# EAGLE design LPC_2TE_3.11PEsmd_only-rdob-millable (EAGLE 6.6.0)
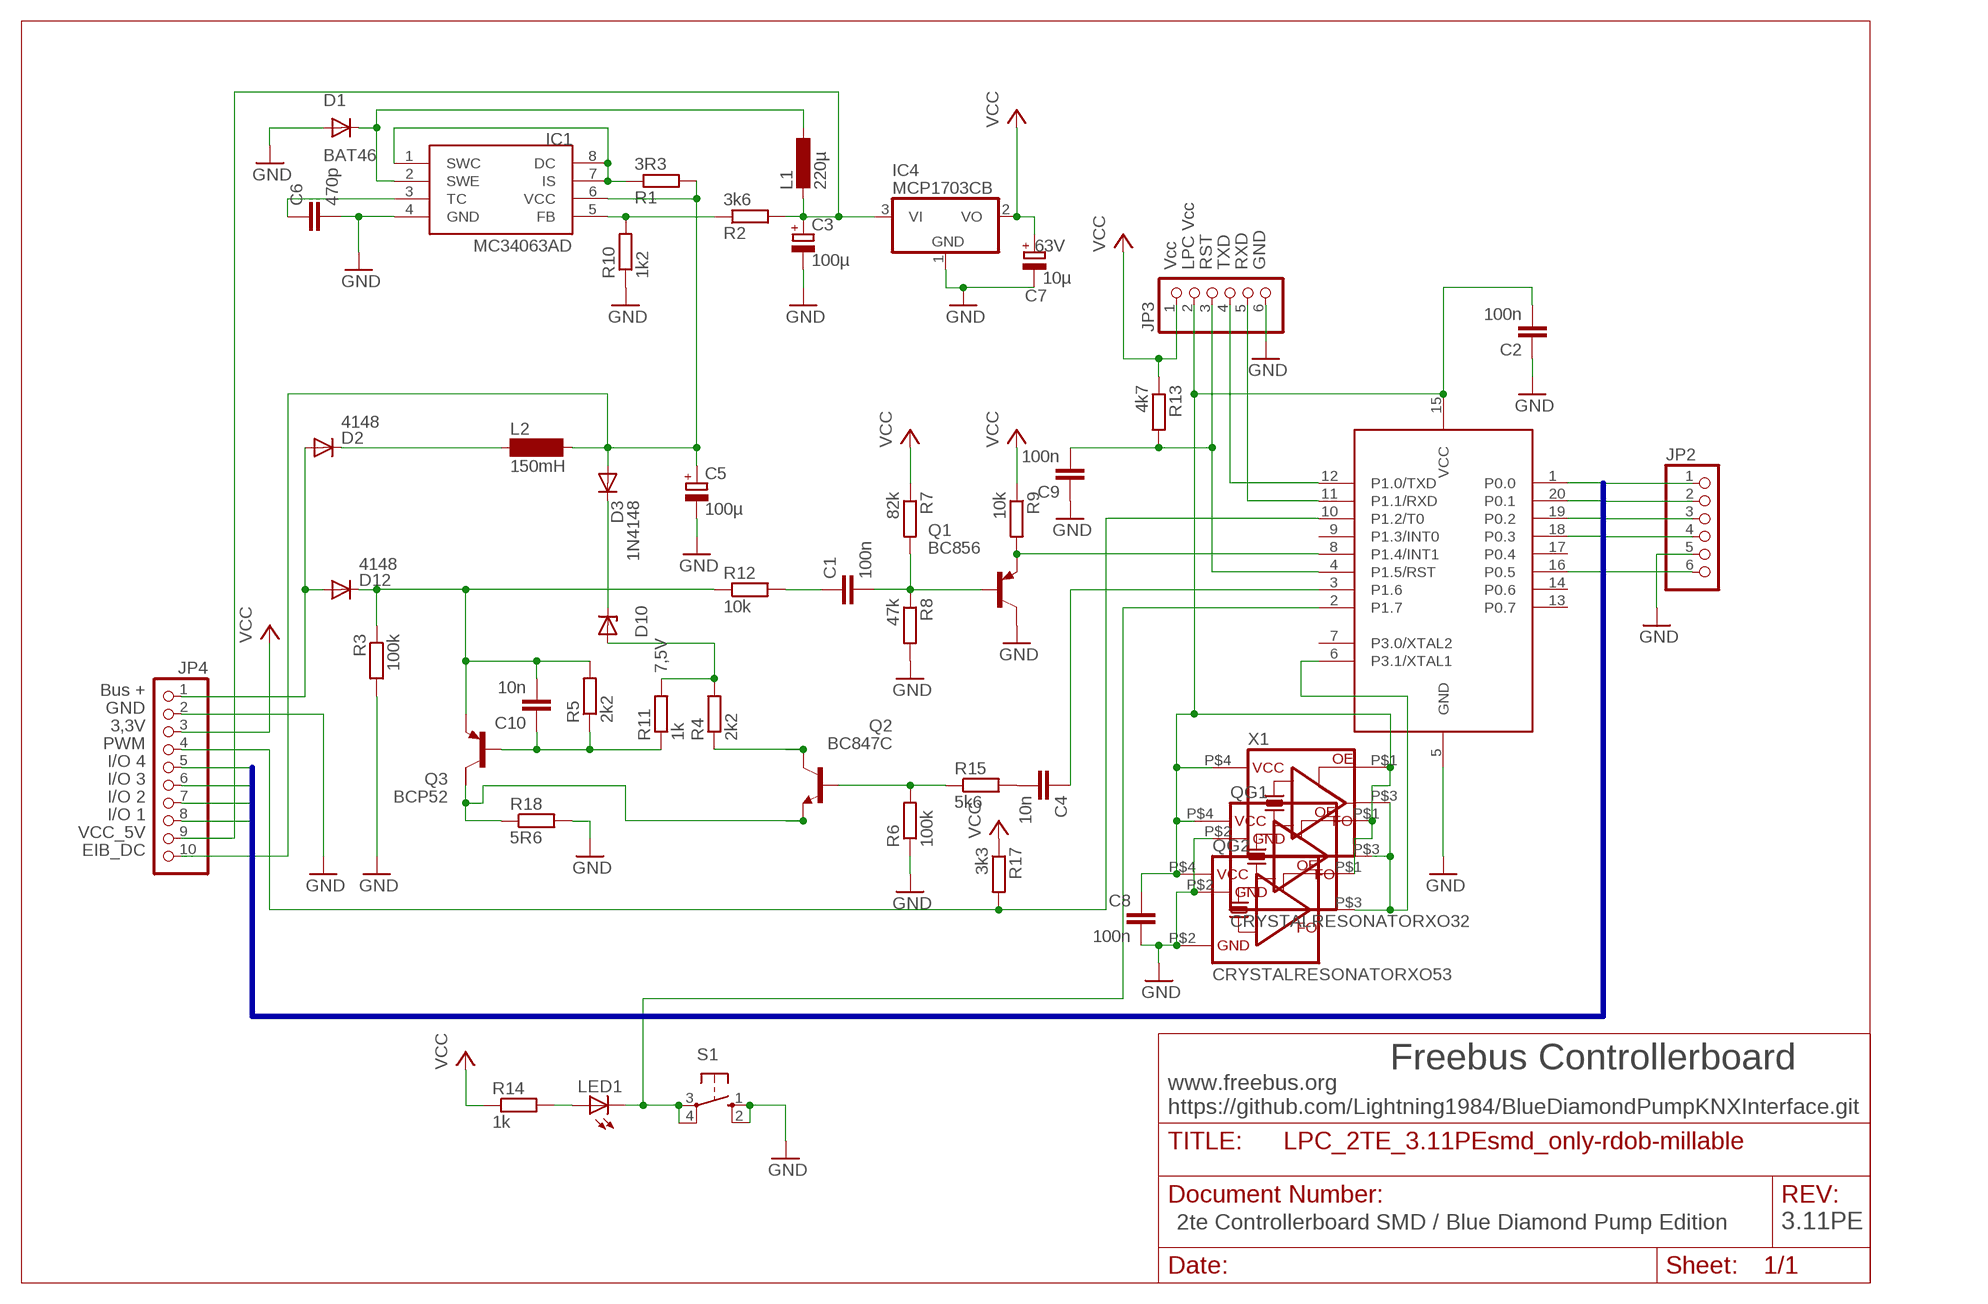
[diagram p0: schematic, sheet 1]

## Parts
C1  100n  C-EUC0805K  [C0805K]
C2  100n  C-EUC0805K  [C0805K]
C3  100µ  CPOL-EUE2.5-6  [E2,5-6]
C4  10n  C-EUC0805K  [C0805K]
C5  100µ  CPOL-EUE3.5-8  [E3,5-8]
C6  470p  C-EUC0805K  [C0805K]
C7  10µ  CPOL-EUE2-5  [E2-5]
C8  100n  C-EUC0805K  [C0805K]
C9  100n  C-EUC0805K  [C0805K]
C10  10n  C-EUC0805K  [C0805K]
D1  BAT46  DIODESOD-123  [SOD-123]
D2  4148  DIODE-MINIMELF  [MINIMELF]
D3  1N4148  DIODE-MINIMELF  [MINIMELF]
D10  7,5V  ZPD  [MINIMELF]
D12  4148  DIODE-MINIMELF  [MINIMELF]
IC1  MC34063AD  [SOIC8]
IC2  LPC922FDH  [TSSOP20]
IC4  MCP1703CB  [SOT23]
JP2  PINHD-1X06_2.54-0.70MM-DRILL  [1X06-0.70DRILL]
JP3  PINHD-1X06_2.54-0.90MM-DRILL  [1X06-0.90DRILL]
JP4  PINHD-1X10_2.54-S0.70MM-DRILL  [1X10-0.70DRILL]
L1  220µ  L-EUPIS28XX  [PIS28XX]
L2  150mH  BS11  [BS11]
LED1  LEDSMT1206  [1206]
Q1  BC856  BC856BSMD  [SOT23-BEC]
Q2  BC847C  BC847CSMD  [SOT23]
Q3  BCP52  FZT753SMD  [SOT223]
QG1  CRYSTALRESONATORXO32  [XO32]
QG2  CRYSTALRESONATORXO53  [XO53]
R1  3R3  R-EU_R1206  [R1206]
R2  3k6  R-EU_R1206  [R1206]
R3  100k  R-EU_R1206  [R1206]
R4  2k2  R-EU_R1206  [R1206]
R5  2k2  R-EU_R1206  [R1206]
R6  100k  R-EU_R1206  [R1206]
R7  82k  R-EU_R1206  [R1206]
R8  47k  R-EU_R1206  [R1206]
R9  10k  R-EU_R1206  [R1206]
R10  1k2  R-EU_R1206  [R1206]
R11  1k  R-EU_R1206  [R1206]
R12  10k  R-EU_R1206  [R1206]
R13  4k7  R-EU_R1206  [R1206]
R14  1k  R-EU_R1206  [R1206]
R15  5k6  R-EU_R1206  [R1206]
R17  3k3  R-EU_R1206  [R1206]
R18  5R6  R-EU_R1206  [R1206]
S1  10-XX  [B3F-10XX]
X1  CRYSTALRESONATORXO91  [XO91]

## Nets
/RESET: C9.2 IC2.4(P1.5/RST) JP3.3 R13.2
BASE: C1.2 Q1.B R7.2 R8.1
BASE_SEND: Q2.1(B) R6.2 R15.1
EIB+: D2.A D12.A JP4.1
EIB_DC: C5.+ D3.A IC1.6(VCC) JP4.10 L2.2 R1.2
FEEDBACK: IC1.5(FB) R2.1 R10.2
GND: C2.1 C3.- C5.- C6.2 C7.- C8.2 C9.1 D1.A IC1.4(GND) IC2.5(GND) IC4.1(GND) JP2.5 JP3.6 JP4.2 Q1.C QG1.P$2(GND) QG2.P$2(GND) R3.2 R6.1 R8.2 R10.1 R18.2 S1.1(S) S1.2(S1) X1.P$2(GND)
I_SENSE: Q2.2(E) Q3.2(C) R18.1
N$1: Q2.3(C) R4.1
N$4: C10.2 D12.C Q3.3(E) R3.1 R5.2 R12.1
N$6: IC2.6(P3.1/XTAL1) QG1.P$3(FO) QG2.P$3(FO) X1.P$3(FO)
N$8: IC1.1(SWC) IC1.7(IS) IC1.8(DC) R1.1
N$9: LED1.A R14.2
N$13: D2.C L2.1
N$14: C6.1 IC1.3(TC)
N$15: D3.C D10.C
N$16: C1.1 R12.2
N$17: C4.2 R15.2
N$28: C10.1 Q3.1(B) R5.1 R11.1
P0.0: IC2.1(P0.0) JP2.1 JP4.8
P0.1: IC2.20(P0.1) JP2.2 JP4.7
P0.2: IC2.19(P0.2) JP2.3 JP4.6
P0.3: IC2.18(P0.3) JP2.4 JP4.5
P0.5: IC2.16(P0.5) JP2.6
PROG: IC2.2(P1.7) LED1.C S1.3(P) S1.4(P1)
PWM: IC2.10(P1.2/T0) JP4.4 R17.2
REFERENZ: D10.A R4.2 R11.2
RXD: IC2.11(P1.1/RXD) JP3.5
SIGIN: IC2.8(P1.4/INT1) Q1.E R9.2
SIGOUT: C4.1 IC2.3(P1.6)
SWITCHED: D1.C IC1.2(SWE) L1.2
TXD: IC2.12(P1.0/TXD) JP3.4
VCC: C7.+ IC4.2(VO) JP3.1 JP4.3 R7.1 R9.1 R13.1 R14.1 R17.1
VCC_5V: C3.+ IC4.3(VI) JP4.9 L1.1 R2.2
VCC_LPC: C2.2 C8.1 IC2.15(VCC) JP3.2 QG1.P$1(OE) QG1.P$4(VCC) QG2.P$1(OE) QG2.P$4(VCC) X1.P$1(OE) X1.P$4(VCC)
Unconnected: IC2.7(P3.0/XTAL2) IC2.9(P1.3/INT0) IC2.13(P0.7) IC2.14(P0.6) IC2.17(P0.4) Q3.4(C/)

## Buses
P0.[0..3]

## Notes on the sheet
- Vcc | LPC Vcc | RST | TXD | RXD | GND
- Bus +
- GND
- 3,3V
- PWM
- I/O 4
- I/O 3
- I/O 2
- I/O 1
- VCC_5V
- EIB_DC
- Freebus Controllerboard
- www.freebus.org
  https://github.com/Lightning1984/BlueDiamondPumpKNXInterface.git
- 2te Controllerboard SMD / Blue Diamond Pump Edition | 3.11PE

## Library data of the parts
C1 C2 C4 C6 C8-C10 = rcl:C-EU: CAPACITOR, European symbol
C3 C5 = rcl:CPOL-EU: POLARIZED CAPACITOR, European symbol
C7 = rcl:CPOL-EU: POLARIZED CAPACITOR, European symbol; VOLTAGE: 63V
D1 = adafruit-2:DIODE: Diode SMADIODE - SMA Surface Mount Package 20V 1A Schottky Diode Digikey: 641-1014-6-ND DO-1N4148 - Through Hole Small Current Diode SOD-123 20V 1 A (.5mV Vf) Schottky Diode - Digikey: MBRX120TPMSCT-ND SOD-323 10V 570mA (.38mV Vf, 3ns) Schottky Diode - Digikey: ZLLS410CT-ND SOD-523 30V 30mA Schottky Diode (RB751S-40TE61) - Digikey: RB751S-40TE61CT-ND SOT23-R/W - SOT23 Package (R = Solder Paste/Reflow Ovens, W = Hand-Soldering) BAT54Film 40V 300mA - Digikey: 497-7162-1-ND
D2 D3 D12 = diode:DIODE-: DIODE
D10 = diode:ZPD: Z DIODE 500 mW
IC1 = mc34063:MC34063
IC2 = LPCGira:LPC922FDH
IC4 = linear:MCP1703: 250 mA, 16V, Low Quiescent Current LDO Regulator Source: http://ww1.microchip.com/downloads/en/DeviceDoc/22049b.pdf
JP2 JP3 = pinhead-2:PINHD-1X06: PIN HEADER
JP4 = pinhead-2:PINHD-1X10: PIN HEADER
L1 = Inductor-Fastron:L-EU
L2 = inductor-neosid:BS: INDUCTOR nominal inductance, magnetically screened
LED1 = led:LED: LED OSRAM: - CHIPLED LG R971, LG N971, LY N971, LG Q971, LY Q971, LO R971, LY R971 LH N974, LH R974 LS Q976, LO Q976, LY Q976 LO Q996 - Hyper CHIPLED LW Q18S LB Q993, LB Q99A, LB R99A - SideLED LS A670, LO A670, LY A670, LG A670, LP A670 LB A673, LV A673, LT A673, LW A673 LH A674 LY A675 LS A676, LA A676, LO A676, LY A676, LW A676 LS A679, LY A679, LG A679 - Hyper Micro SIDELED® LS Y876, LA Y876, LO Y876, LY Y876 LT Y87S - SmartLED LW L88C, LW L88S LB L89C, LB L89S, LG L890 LS L89K, LO L89K, LY L89K LS L896, LA L896, LO L896, LY L896 - TOPLED LS T670, LO T670, LY T670, LG T670, LP T670 LSG T670, LSP T670, LSY T670, LOP T670, LYG T670 LG T671, LOG T671, LSG T671 LB T673, LV T673, LT T673, LW T673 LH T674 LS T676, LA T676, LO T676, LY T676, LB T676, LH T676, LSB T676, LW T676 LB T67C, LV T67C, LT T67C, LS T67K, LO T67K, LY T67K, LW E67C LS E67B, LA E67B, LO E67B, LY E67B, LB E67C, LV E67C, LT E67C LW T67C LS T679, LY T679, LG T679 LS T770, LO T770, LY T770, LG T770, LP T770 LB T773, LV T773, LT T773, LW T773 LH T774 LS E675, LA E675, LY E675, LS T675 LS T776, LA T776, LO T776, LY T776, LB T776 LHGB T686 LT T68C, LB T68C - Hyper Mini TOPLED® LB M676 - Mini TOPLED Santana® LG M470 LS M47K, LO M47K, LY M47K Source: http://www.osram.convergy.de LUXEON: - LUMILED® LXK2-PW12-R00, LXK2-PW12-S00, LXK2-PW14-U00, LXK2-PW14-V00 LXK2-PM12-R00, LXK2-PM12-S00, LXK2-PM14-U00 LXK2-PE12-Q00, LXK2-PE12-R00, LXK2-PE12-S00, LXK2-PE14-T00, LXK2-PE14-U00 LXK2-PB12-K00, LXK2-PB12-L00, LXK2-PB12-M00, LXK2-PB14-N00, LXK2-PB14-P00, LXK2-PB14-Q00 LXK2-PR12-L00, LXK2-PR12-M00, LXK2-PR14-Q00, LXK2-PR14-R00 LXK2-PD12-Q00, LXK2-PD12-R00, LXK2-PD12-S00 LXK2-PH12-R00, LXK2-PH12-S00 LXK2-PL12-P00, LXK2-PL12-Q00, LXK2-PL12-R00 Source: www.luxeon.com KINGBRIGHT: KA-3528ASYC Source: www.kingbright.com
Q1 = transistor-pnp:BC856*: PNP Transistror
Q2 = transistor-npn:BC847*: NPN Transistor
Q3 = transistor-pnp:FZT753SMD: PNP Transistor
QG1 QG2 X1 = Crystals-new:CRYSTALRESONATOR
R1-R15 R17 R18 = rcl:R-EU_: RESISTOR, European symbol
S1 = switch-omron:10-XX: OMRON SWITCH

## Board
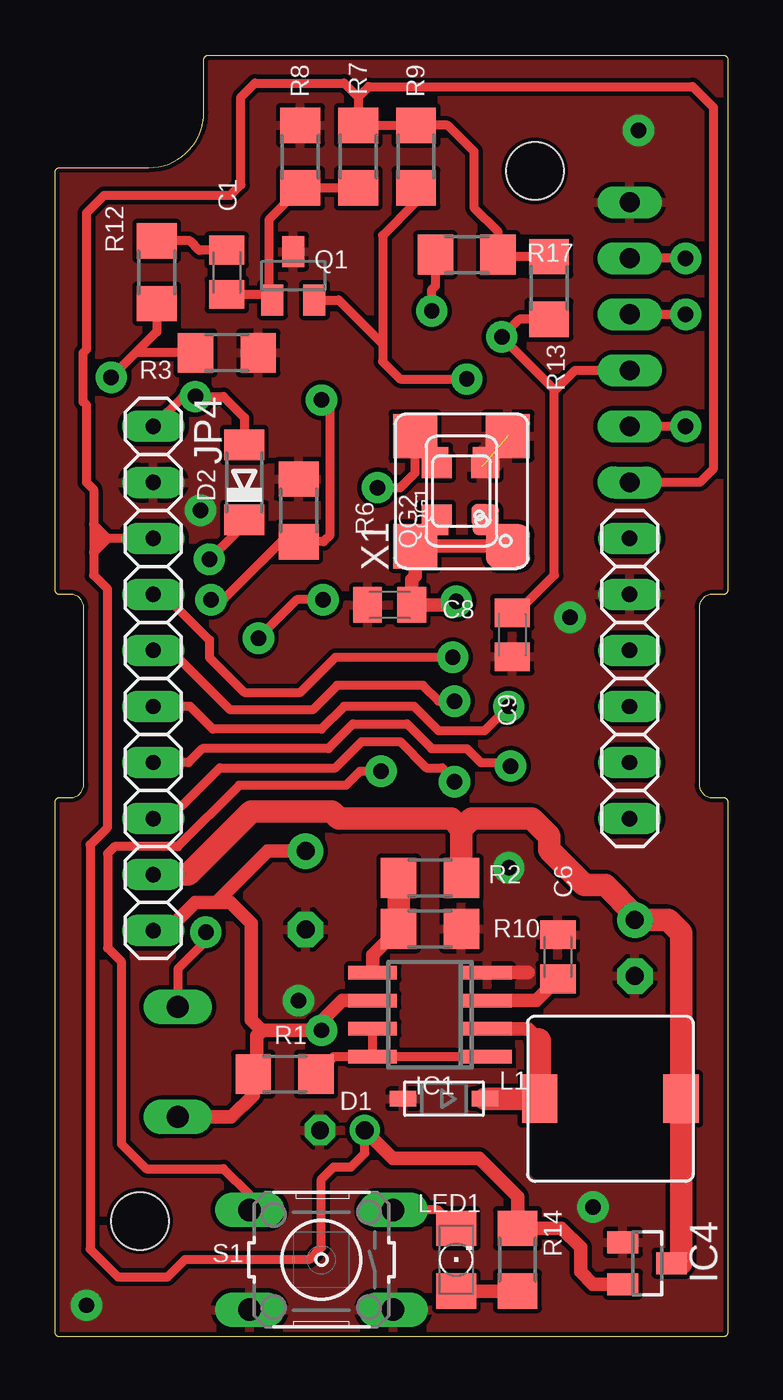
[diagram p1: board, top side]
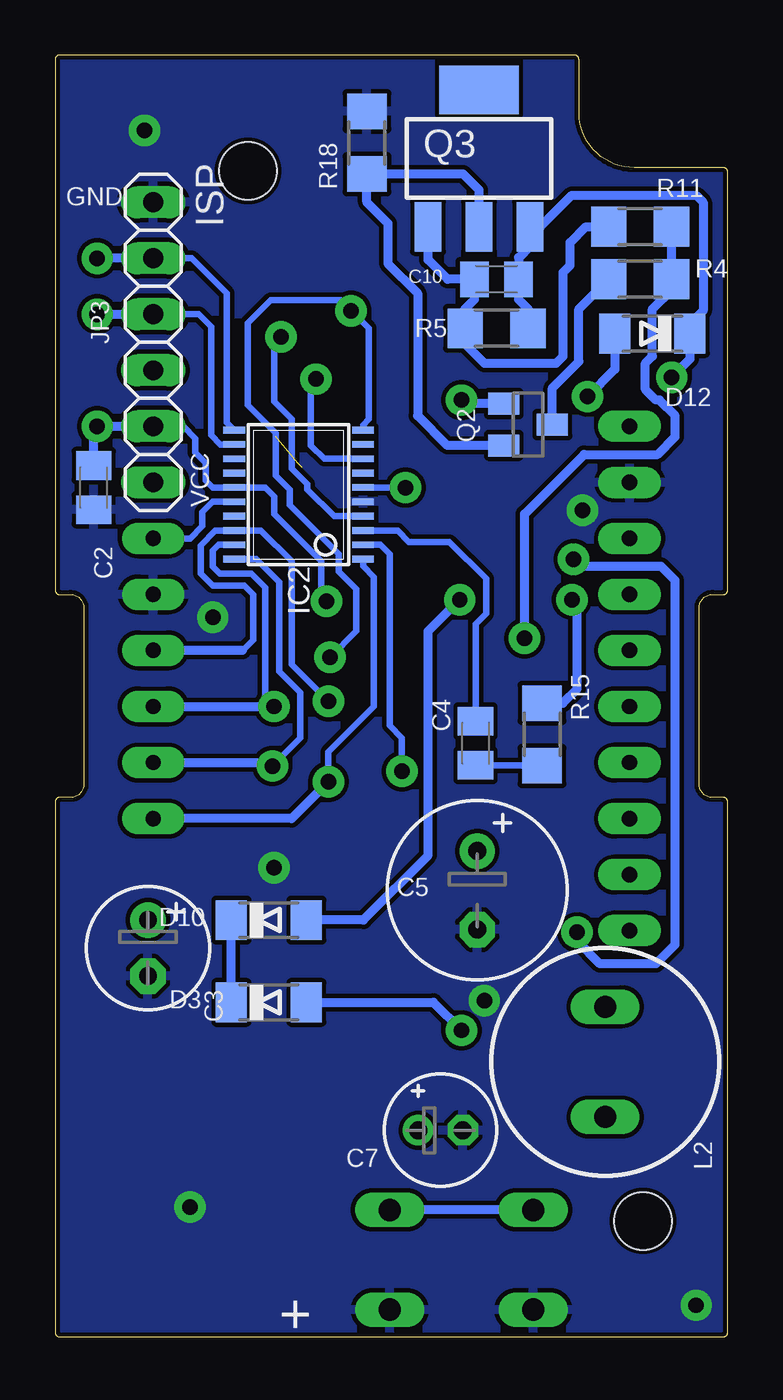
[diagram p2: board, bottom side, seen from below]

Size 30.48 x 58.1 mm. Coordinates in mm from the lower left corner, seen from the top.
Outline: 29.78,24.45 30.28,24.45 arc-90 30.48,24.25 30.48,0.2 arc-90 30.28,0 0.2,0 arc-90 0,0.2 0,24.25 arc-90 0.2,24.45 0.7,24.45 arc90 1.3,25.05 1.3,33.05 arc90 0.7,33.65 0.2,33.65 arc-90 0,33.85 0,52.8 arc-90 0.2,53 4.24,53 arc90 6.74,55.5 6.74,57.9 arc-90 6.94,58.1 30.28,58.1 arc-90 30.48,57.9 30.48,33.85 arc-90 30.28,33.65 29.78,33.65 arc90 29.18,33.05 29.18,25.05 arc90 29.78,24.45
Copper layers (1*16): Top 0.035mm / dielectric 1.5mm / Bottom 0.035mm
Design rules "default *": minimum track width 12mil, minimum drill 24mil, track to track 0.2mm, track to pad 0.2mm, pad to pad 0.2mm, via to via 0.2mm, smd to smd 0.2mm, copper to edge 0.2mm, drill to drill 8mil, minimum pad ring 11mil, minimum via ring 8mil, stop-mask expansion 4mil, vias tented up to drill 0mil, thermal gap 0.2mm
Holes 2.6 mm at 3.84,5.25 21.74,52.85
tRestrict: area 21.4,7.1 to 28.9,14.5

### Footprints (pad centres in the part's own frame; a part is rotated, then mirrored left to right if it is on the bottom)
C0805K = smd 1.3 x 1.6: 1 -1,0; 2 1,0
E2,5-6 = drill 0.813 pad 1.6: + -1.27,0 | drill 0.813 pad 1.6 octagon: - 1.27,0
E3,5-8 = drill 0.813 pad 1.6: + -1.778,0 | drill 0.813 pad 1.6 octagon: - 1.778,0
E2-5 = drill 0.813 pad 1.27: + -1.016,0 | drill 0.813 pad 1.27 octagon: - 1.016,0
SOD-123 = smd 1.2 x 0.7: A 1.85,0; C -1.85,0
MINIMELF = smd 1.4 x 1.8: A 1.7,0; C -1.7,0
SOIC8 = smd 0.6 x 2.2: 1 -1.905,-2.6; 2 -0.635,-2.6; 3 0.635,-2.6; 4 1.905,-2.6; 5 1.905,2.6; 6 0.635,2.6; 7 -0.635,2.6; 8 -1.905,2.6
TSSOP20 = smd 0.305 x 0.991: 1 -2.925,-2.918; 2 -2.275,-2.918; 3 -1.625,-2.918; 4 -0.975,-2.918; 5 -0.325,-2.918; 6 0.325,-2.918; 7 0.975,-2.918; 8 1.625,-2.918; 9 2.275,-2.918; 10 2.925,-2.918; 11 2.925,2.918; 12 2.275,2.918; 13 1.625,2.918; 14 0.975,2.918; 15 0.325,2.918; 16 -0.325,2.918; 17 -0.975,2.918; 18 -1.625,2.918; 19 -2.275,2.918; 20 -2.925,2.918
SOT23 = smd 1 x 1.4: 1 -0.95,-1.1; 2 0.95,-1.1; 3 0,1.1
1X06-0.70DRILL = drill 0.7 pad 1.422 long: 1 -6.35,0; 2 -3.81,0; 3 -1.27,0; 4 1.27,0; 5 3.81,0; 6 6.35,0
1X06-0.90DRILL = drill 0.9 pad 1.422 long: 1 -6.35,0; 2 -3.81,0; 3 -1.27,0; 4 1.27,0; 5 3.81,0; 6 6.35,0
1X10-0.70DRILL = drill 0.7 pad 1.422 long: 1 -11.43,0; 2 -8.89,0; 3 -6.35,0; 4 -3.81,0; 5 -1.27,0; 6 1.27,0; 7 3.81,0; 8 6.35,0; 9 8.89,0; 10 11.43,0
PIS28XX = smd 1.6 x 2.2: 1 -3.2,0; 2 3.2,0
BS11 = drill 1 long: 1 -2.5,0; 2 2.5,0
1206 = smd 1.6 x 1.803: A -1.422,0; C 1.422,0
SOT23-BEC = smd 1 x 1.4: B -0.95,-1.1; C 0,1.1; E 0.95,-1.1
SOT223 = smd 1.219 x 2.235: 1 -2.311,-3.099; 2 0,-3.099; 3 2.311,-3.099 | smd 3.6 x 2.2: 4 0,3.099
XO32 = smd 1 x 0.9: P$1 -1.1,-0.9; P$2 1.1,-0.9; P$3 1.1,0.9; P$4 -1.1,0.9
XO53 = smd 1.4 x 1.2: P$1 -1.3,-1.1; P$2 1.3,-1.1; P$3 1.3,1.2; P$4 -1.3,1.2
R1206 = smd 1.6 x 1.803: 1 -1.422,0; 2 1.422,0
B3F-10XX = drill 1.016 long: 1 -3.251,2.261; 2 3.251,2.261; 3 -3.251,-2.261; 4 3.251,-2.261
XO91 = smd 2 x 2: P$1 -2.5,-2.1; P$2 2.5,-2.1; P$3 2.5,2.1; P$4 -2.5,2.1

### Placement (x,y rotation side)
C1  7.78,48.26 270 top
C2  28.73,38.5 90 bottom
C3  26.27,17.62 270 bottom
C4  11.43,26.91 270 bottom
C5  11.35,20.24 270 bottom
C6  22.78,17.22 90 top
C7  13.02,9.37 0 bottom
C8  15.16,33.18 180 top
C9  20.72,31.83 90 top
C10  10.48,47.94 0 bottom
D1  17.62,10.79 180 top
D2  8.57,38.73 90 top
D3  20.8,15.16 0 bottom
D10  20.8,18.89 0 bottom
D12  3.41,45.48 180 bottom
IC1  16.99,14.61 90 top
IC2  19.45,38.18 90 bottom
IC4  26.83,3.33 270 top
JP2  26.04,29.84 90 top
JP3  26.04,45.09 90 bottom
JP4  4.45,29.84 270 top
L1  25.16,10.79 180 top
L2  5.56,12.46 270 bottom
LED1  18.18,3.49 90 top
Q1  10.79,48.1 0 top
Q2  9.05,41.35 270 bottom
Q3  11.27,53.42 0 bottom
QG1  18.41,38.34 90 top
QG2  18.41,38.34 90 top
R1  10.4,11.91 180 top
R2  16.99,20.8 0 top
R3  7.78,44.61 0 top
R4  3.97,47.94 0 bottom
R5  10.48,45.72 0 bottom
R6  11.03,37.47 270 top
R7  13.73,53.5 270 top
R8  11.11,53.5 90 top
R9  16.35,53.5 270 top
R10  16.99,18.49 180 top
R11  3.97,50.32 0 bottom
R12  4.6,48.26 90 top
R13  22.38,47.55 270 top
R14  20.95,3.49 270 top
R15  8.41,27.3 270 bottom
R17  18.65,49.05 180 top
R18  16.35,54.13 90 bottom
S1  12.07,3.49 180 top
X1  18.41,38.34 90 top

### Tracks (layer width: path | path; a pad name or v marks a point on that pad's centre or on a via)
/RESET  (via drill 0.7 pad 1.42)
  Top 0.406: 22.62,42.86 22.62,34.53 20.92,32.83 C9.2 | 22.62,42.86 22.62,42.94 v20.24,45.32 21.04,46.12 R13.2 | 22.62,42.86 23.57,43.82 JP3.3
  Bottom 0.305: v20.24,45.32 20.56,45.01 20.56,42.39 19.76,41.59 19.76,39.37 19.05,38.66 19.05,38.42 17.84,37.2 IC2.4
BASE
  Top 0.406: R7.2 R8.1 11.11,52.07 9.68,50.64 9.68,47.16 Q1.B 9.59,47.26 C1.2
BASE_SEND  (via drill 0.7 pad 1.42)
  Top 0.406: 11.03,35.96 R6.2 | v12.07,42.47 12.46,42.07 12.46,36.35 12.15,36.04 R6.2 | v7.06,33.42 7.62,33.42 10.25,36.04 R6.2
  Bottom 0.406: v7.06,33.42 6.83,33.18 6.83,29.37 7.47,28.73 R15.1 | Q2.1 11.9,42.3 v12.07,42.47
EIB+  (via drill 0.7 pad 1.42)
  Top 0.406: JP4.1 5.79,42.62 v6.35,42.62 7.62,42.62 8.57,41.67 D2.A
  Bottom 0.406: v6.35,42.62 5.11,43.86 D12.A
EIB_DC  (via drill 0.7 pad 1.42)
  Top 0.406: IC1.6 13.57,15.24
  Top 0.61: L2.2 7.98,9.96 8.98,10.95 R1.2 9.13,11.91 9.13,13.65 9.37,13.89 | C5.+ 9.64,22.02 7.3,19.69 | 13.57,15.24 13.02,15.24 12.07,14.29 v12.07,13.89 9.37,13.89 | JP4.10 5.08,18.42 6.35,19.69 7.3,19.69 | 7.3,19.69 7.94,19.69 8.89,18.73 8.89,14.37 9.37,13.89
  Bottom 0.406: D3.A 13.34,15.16 v12.07,13.89
FEEDBACK
  Top 0.61: IC1.5 14.39,17.32 R10.2
  Top 1.016: R2.1 R10.2
GND  (via drill 0.7 pad 1.42)  (2 unrouted)
  Top 0.61: IC1.4 21.43,16.51
  other vias: 23.34,32.62 1.43,1.43 26.43,54.69 24.37,5.87 6.59,37.47 11.03,15.24 20.56,21.27
  pour Top: 33.02,59.53 -2.54,59.53 -2.54,-1.43 33.02,-1.43
  pour Bottom: -2.54,59.53 -2.54,-1.43 33.02,-1.43 33.02,59.53
I_SENSE
  Bottom 0.406: Q3.2 11.27,51.99 11.99,52.71 R18.1 16.35,51.44 15.4,50.48 15.4,48.66 14.05,47.31 14.05,41.75 12.7,40.4 Q2.2
N$1
  Bottom 0.406: R4.1 6.75,46.59 6.75,44.21 7.95,43.01 Q2.3
N$4  (via drill 0.7 pad 1.42)
  Top 0.406: R3.1 3.65,44.61 | 3.65,44.61 v2.54,43.5 | R12.1 4.6,45.56 3.65,44.61
  Bottom 0.406: R5.2 9.06,46.6 9.48,47.02 C10.2 9.48,48.93 8.97,49.44 Q3.3 8.5,50.32 7.06,51.75 1.43,51.75 1.11,51.44 1.11,46.51 1.71,45.91 D12.C 1.71,44.32 v2.54,43.5
N$6  (via drill 0.7 pad 1.42)
  Top 0.406: v14.61,38.5 15.64,38.5 16.32,39.18 X1.P$3 16.32,40.54 QG2.P$3 17.32,39.64 QG1.P$3
  Bottom 0.305: IC2.6 14.61,38.5 v14.61,38.5
N$8
  Top 0.406: IC1.8 IC1.7 | IC1.1 IC1.8 | IC1.8 12.62,12.7 R1.1
N$9
  Top 0.61: R14.2 LED1.A
N$13  (via drill 0.7 pad 1.42)
  Top 0.406: v6.98,35.24 8.57,36.83 D2.C | v6.83,18.34 6.83,17.94 5.56,16.67 L2.1
  Bottom 0.406: v6.98,35.24 6.67,34.93 3.02,34.93 2.38,34.29 2.38,17.78 3.25,16.91 5.79,16.91 6.83,17.94 v6.83,18.34
N$14
  Top 0.61: IC1.3 21.8,15.24 C6.1
N$15
  Bottom 0.406: D3.C D10.C
N$16
  Top 0.406: C1.1 6.54,49.26 6.12,49.68 R12.2
N$17
  Bottom 0.305: R15.2 8.44,25.91 C4.2
N$28
  Bottom 0.406: R11.1 6.43,50.32 7.14,49.61 7.14,48.58 7.46,48.26 7.46,44.45 7.78,44.13 11.03,44.13 11.9,45 R5.1 11.9,46.6 11.48,47.02 C10.1 12.7,47.94 13.58,48.83 Q3.1
P0.0  (via drill 0.7 pad 1.42)
  Top 0.406: JP4.8 5.16,23.5 7.46,25.8 12.7,25.8 13.89,26.99 15.64,26.99 16.83,25.8 17.54,25.8 18.1,25.24 v18.1,25.16
  Bottom 0.305: v18.1,25.16 18.1,26.51 16.03,28.58 16.03,34.45 16.53,34.94 IC2.1
  Bottom 0.406: v18.1,25.16 19.76,23.5 JP2.1
P0.1  (via drill 0.7 pad 1.42)
  Top 0.406: JP4.7 6.03,26.04 6.67,26.67 12.38,26.67 13.49,27.78 15.95,27.78 17.07,26.67 18.65,26.67 19.29,26.04 20.48,26.04 v20.64,25.88
  Bottom 0.305: v20.64,25.88 19.37,27.15 19.37,29.21 20.32,30.16 20.32,34.21 21.36,35.25 IC2.20
  Bottom 0.406: JP2.2 20.8,26.04 v20.64,25.88
P0.2  (via drill 0.7 pad 1.42)
  Top 0.406: JP4.6 6.11,28.58 7.14,27.54 12.07,27.54 13.1,28.58 16.27,28.58 17.38,27.46 19.45,27.46 v20.56,28.58
  Bottom 0.305: v20.56,28.58 20.95,28.97 20.95,33.97 21.59,34.61 23.02,34.61 23.34,34.93 23.34,35.64 23.07,35.9 IC2.19
  Bottom 0.406: JP2.3 v20.56,28.58
P0.3  (via drill 0.7 pad 1.42)
  Top 0.406: v18.1,28.81 17.38,28.81 16.67,29.53 12.78,29.53 11.67,28.42 7.94,28.42 5.24,31.12 JP4.5
  Bottom 0.305: v18.1,28.81 19.76,30.48 19.76,35.16 21.16,36.55 IC2.18 23.21,36.55 23.89,35.88 23.89,34.61 23.34,34.05 21.91,34.05 21.51,33.66 21.51,31.59 21.99,31.12
  Bottom 0.406: 21.99,31.12 JP2.4
P0.5
  Bottom 0.305: JP2.6 24.37,36.2 23.81,36.75 23.81,37.39 23.34,37.85 IC2.16
PROG  (via drill 0.7 pad 1.42)
  Top 0.406: v14.76,25.64 13.81,25.64 13.18,25 8.33,25 5.56,22.23 2.7,22.23 2.38,21.91 2.38,17.62 3.02,16.99 3.02,8.73 4.13,7.62 7.62,7.62 8.81,6.43 S1.4 | LED1.C 17.34,5.75 S1.3
  Bottom 0.305: v14.76,25.64 14.76,27.15 15.32,27.7 15.32,35.48 15.74,35.9 IC2.2
  Bottom 0.406: S1.4 S1.3
PWM  (via drill 0.7 pad 1.42)
  Top 0.406: v18.02,30.8 12.7,30.8 11.11,29.21 8.57,29.21 6.98,30.8 6.98,31.59 4.92,33.66 JP4.4 | v17.07,46.51 17.07,47.47 17.23,47.63 R17.2
  Bottom 0.305: v18.02,30.8 16.83,31.99 16.83,33.89 17.62,34.69 17.62,35.48 19.84,37.7 19.84,38.42 20.48,39.05 20.48,40.96 21.75,42.23 21.75,45.96 20.72,46.99 17.54,46.99 v17.07,46.51 16.27,45.72 16.27,41.59 16.53,41.34 IC2.10
REFERENZ  (via drill 0.7 pad 1.42)
  Top 0.406: v12.14,33.42 10.95,33.42 v9.21,31.67
  Bottom 0.406: v9.21,31.67 9.21,37.31 6.51,40.01 3.18,40.01 2.38,40.8 2.38,41.75 3.1,42.47 3.25,42.47 3.73,42.94 3.73,44.13 3.41,44.45 3.41,46.59 2.55,47.46 R4.2 R11.2 | D10.A 16.51,18.89 13.57,21.83 13.57,31.99 v12.14,33.42
RXD  (via drill 0.7 pad 1.42)
  Top 0.406: v28.58,48.9 JP3.5
  Bottom 0.305: JP3.5 24.29,48.9 22.7,47.31 22.7,41.43 22.37,41.1 IC2.11
  Bottom 0.406: JP3.5 v28.58,48.9
SIGIN  (via drill 0.7 pad 1.42)
  Top 0.406: v18.65,43.42 15.64,43.42 14.84,44.21 14.84,45.01 | R9.2 16.35,51.44 14.84,49.93 14.84,45.01 | Q1.E 12.85,47 14.84,45.01
  Bottom 0.305: v18.65,43.42 18.89,43.18 18.89,40.4 18.29,39.8 IC2.8
SIGOUT
  Bottom 0.305: IC2.3 14.96,36.55 14.45,36.04 12.62,36.04 10.95,34.37 10.95,32.78 11.43,32.31 C4.1
SWITCHED
  Top 0.61: IC1.2 21.43,13.97 21.91,13.49
  Top 1.016: D1.C L1.2 | 21.99,10.8 L1.2 | L1.2 21.96,13.44 21.91,13.49
TXD  (via drill 0.7 pad 1.42)
  Top 0.406: JP3.4 v28.58,46.36
  Bottom 0.305: JP3.4 23.97,46.36 23.42,45.8 23.42,40.88 22.99,40.45 IC2.12
  Bottom 0.406: v28.58,46.36 JP3.4
VCC
  Top 0.406: 1.75,36.83 1.75,38.42 1.43,38.74 1.43,42.23 1.27,42.39 1.27,44.61 1.43,44.77 1.43,50.96 2.22,51.75 7.94,51.75 8.41,52.23 8.41,56.2 9.05,56.83 13.1,56.83 13.73,56.2 | 1.75,36.83 1.75,35.56 | 1.75,35.56 1.75,34.53 2.38,33.89 2.38,23.1 1.59,22.3 1.59,3.97 2.86,2.7 5.08,2.7 5.87,3.49 11.51,3.49 12.07,4.05 12.07,7.14 12.62,7.7 13.41,7.7 14.03,8.32 C7.+ | JP4.3 2.38,36.2 | 2.38,36.2 1.75,36.83 | 2.38,36.2 1.75,35.56 | 2.38,36.2 1.9,36.2 | 13.73,56.2 14.21,56.67 28.89,56.67 29.84,55.72 29.84,39.37 29.21,38.74 JP3.1 | R13.1 20.16,48.97 R17.1 20.07,50.09 18.97,51.2 18.97,53.74 17.79,54.92 R9.1 R7.1 13.73,56.2
  Top 0.61: C7.+ 15.3,8.1 19.21,8.1 20.95,6.35 R14.1 22.95,4.91 23.81,4.05 23.81,2.94 24.37,2.38 IC4.2
VCC_5V
  Top 1.016: IC4.3 28.36,3.33 L1.1 28.36,18.31 27.78,18.89 C3.+ 26.27,19.13 24.92,20.48 23.97,20.48 22.38,22.07 22.38,22.7 21.59,23.5 18.88,23.5 18.41,23.03 | R2.2 18.41,23.03 | 18.41,23.03 17.94,23.5 12.86,23.5 12.54,23.81 8.89,23.81 6.03,20.96 JP4.9
VCC_LPC  (via drill 0.7 pad 1.42)
  Top 0.406: JP3.2 v28.58,41.28 | X1.P$4 17.21,36.74 QG2.P$4 17.41,37.24 QG1.P$4 | QG1.P$1 QG2.P$1 20.52,36.04 X1.P$1
  Top 0.61: X1.P$1 X1.P$4 16.32,34.49 16.16,34.34 C8.1 18.02,33.18 v18.18,33.34
  Bottom 0.305: v18.18,33.34 18.41,33.58 18.41,35.16 20.56,37.31 20.56,38.1 20.96,38.5 IC2.15 23.34,38.5 23.65,38.81 23.65,39.61 24.13,40.08 24.13,40.72 24.69,41.28 JP3.2
  Bottom 0.406: C2.2 28.73,41.12 v28.58,41.28 JP3.2

### Text on the board
bPlace: +
tNames: www.selfbus.org / https://github.com/Lightning1984/BlueDiamondPumpKNXInterface.git | LPC 2te 3.11smd / Modification Rupert Dobrounig / Blue Diamond Pump Edition
bNames: GND | ISP | VCC
bText: Selfbus / LPC 2TE SMD / mod. RDOB / / v.3.11 BDPE / 02.11.2016